# EAGLE design midiprog3c (EAGLE 4.16)
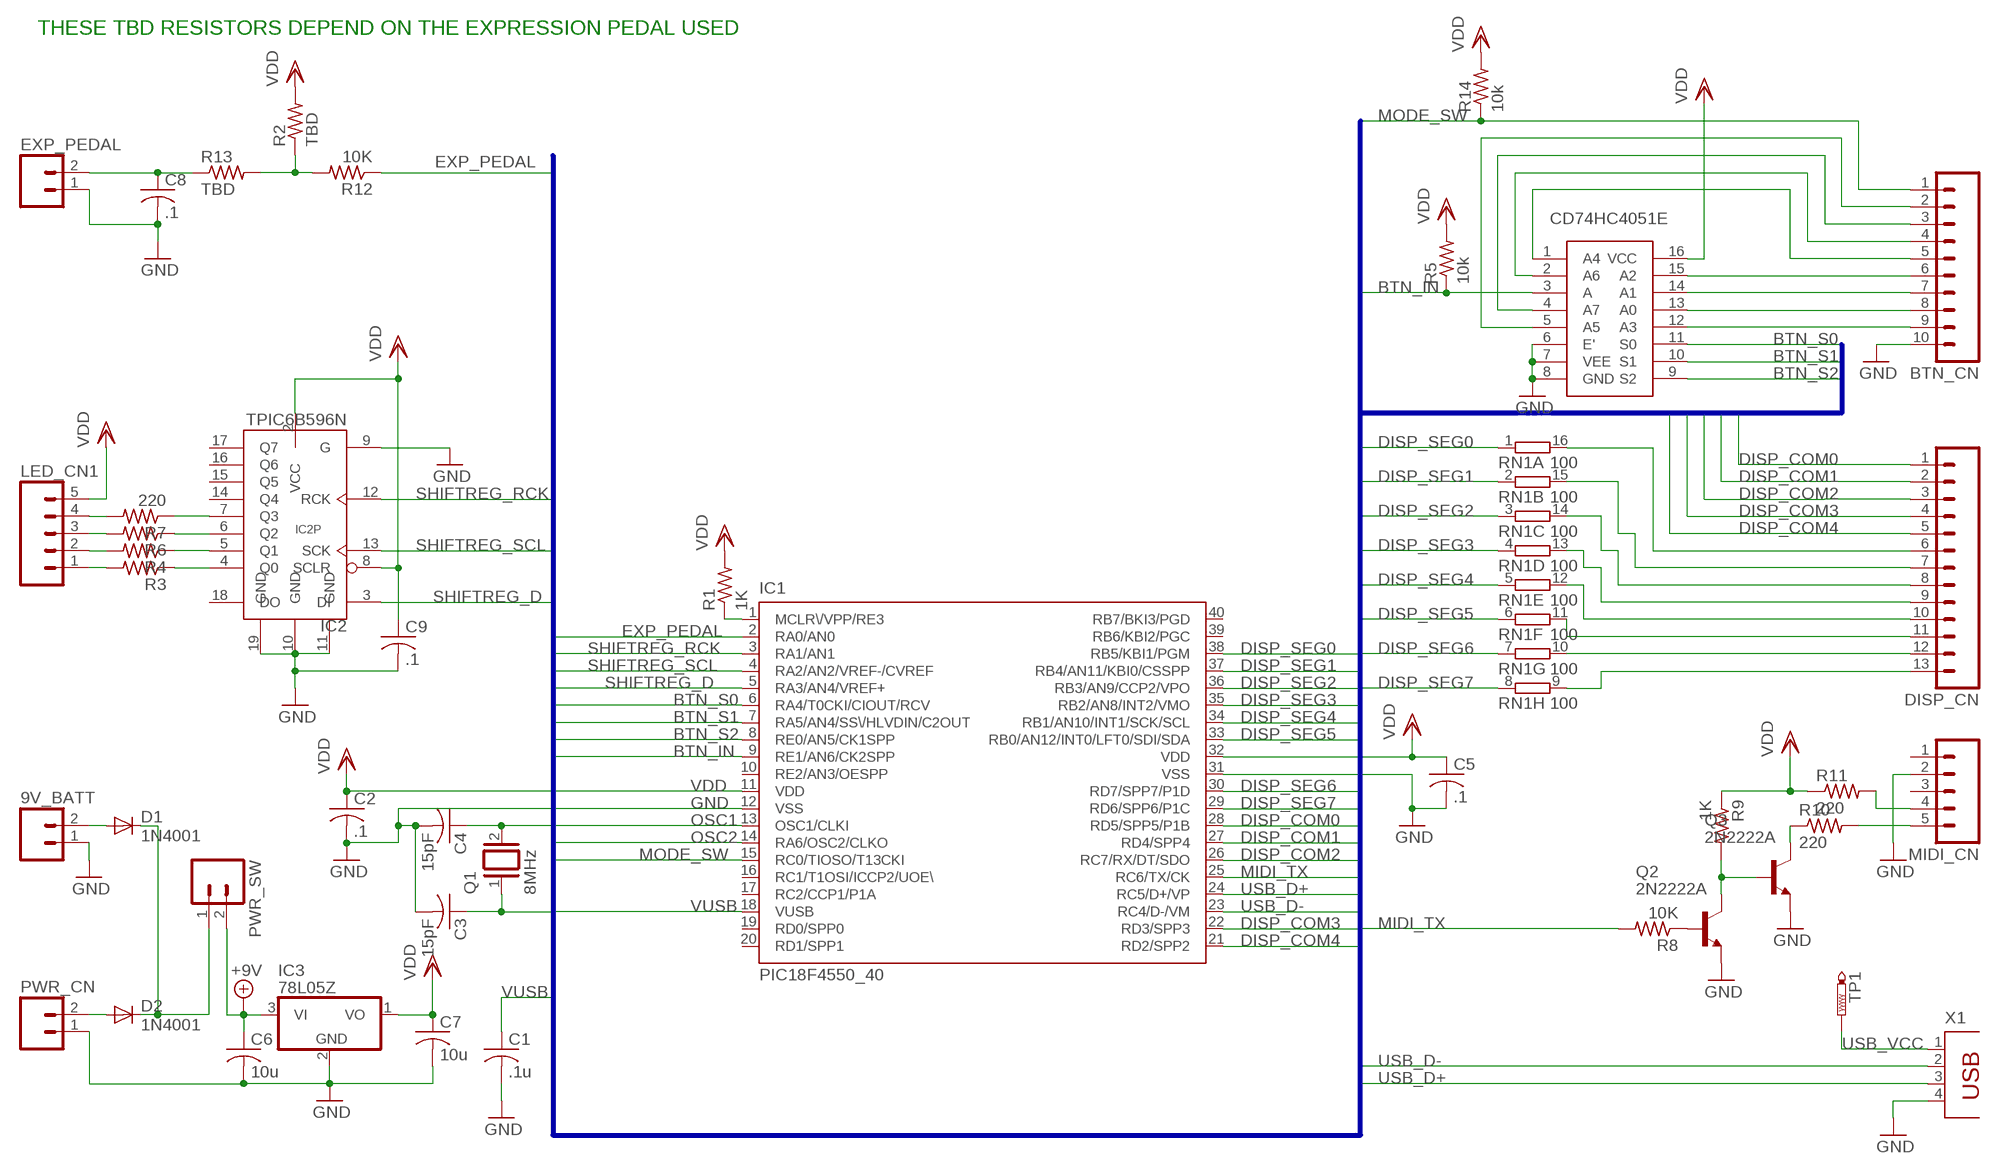
[diagram p0: schematic, sheet 1]

## Parts
9V_BATT  M02  [02P]
BTN_CN  M10  [10P]
C1  .1u  C-US050-025X075  [C050-025X075]
C2  .1  C-US050-025X075  [C050-025X075]
C3  15pF  C-US050-025X075  [C050-025X075]
C4  15pF  C-US050-025X075  [C050-025X075]
C5  .1  C-US050-025X075  [C050-025X075]
C6  10u  C-US050-025X075  [C050-025X075]
C7  10u  C-US050-025X075  [C050-025X075]
C8  .1  C-US050-025X075  [C050-025X075]
C9  .1  C-US050-025X075  [C050-025X075]
D1  1N4001  1N4004  [DO41-10]
D2  1N4001  1N4004  [DO41-10]
DISP_CN  M13  [13P]
EXP_PEDAL  M02  [02P]
IC1  PIC18F4550_40  [DIL40]
IC2  TPIC6B596N  [DIL20]
IC3  78L05Z  [TO92]
LED_CN1  M05  [05P]
MIDI_CN  MA05  [05PA]
PWR_CN  M02  [02P]
PWR_SW  M02  [02P]
Q1  8MHz  XTAL  [Q]
Q2  2N2222A  [TO18]
Q3  2N2222A  [TO18]
R1  1K  R-US_0207/10  [0207/10]
R2  TBD  R-US_0207/10  [0207/10]
R3  R-US_0207/10  [0207/10]
R4  R-US_0207/10  [0207/10]
R5  10k  R-US_0207/10  [0207/10]
R6  R-US_0207/10  [0207/10]
R7  220  R-US_0207/10  [0207/10]
R8  10K  R-US_0207/10  [0207/10]
R9  1K  R-US_0207/10  [0207/10]
R10  220  R-US_0207/10  [0207/10]
R11  220  R-US_0207/10  [0207/10]
R12  10K  R-US_0207/10  [0207/10]
R13  TBD  R-US_0207/10  [0207/10]
R14  10k  R-US_0207/10  [0207/10]
RN1  100  8R-N  [DIL16]
TP1  PTR1PAD1-17  [P1-17]
U$1  CD74HC4051E  [CD74HC4051E]
X1  PN61729  [PN61729]

## Nets
+9V: C6.1 IC3.3(VI) PWR_SW.2
BTN_IN: IC1.9(RE1/AN6/CK2SPP) R5.1 U$1.3(A)
BTN_S0: IC1.6(RA4/T0CKI/CIOUT/RCV) U$1.11(S0)
BTN_S1: IC1.7(RA5/AN4/SS\/HLVDIN/C2OUT) U$1.10(S1)
BTN_S2: IC1.8(RE0/AN5/CK1SPP) U$1.9(S2)
DISP_COM0: DISP_CN.1 IC1.28(RD5/SPP5/P1B)
DISP_COM1: DISP_CN.2 IC1.27(RD4/SPP4)
DISP_COM2: DISP_CN.3 IC1.26(RC7/RX/DT/SDO)
DISP_COM3: DISP_CN.4 IC1.22(RD3/SPP3)
DISP_COM4: DISP_CN.5 IC1.21(RD2/SPP2)
DISP_SEG0: IC1.38(RB5/KBI1/PGM) RN1.1
DISP_SEG1: IC1.37(RB4/AN11/KBI0/CSSPP) RN1.2
DISP_SEG2: IC1.36(RB3/AN9/CCP2/VPO) RN1.3
DISP_SEG3: IC1.35(RB2/AN8/INT2/VMO) RN1.4
DISP_SEG4: IC1.34(RB1/AN10/INT1/SCK/SCL) RN1.5
DISP_SEG5: IC1.33(RB0/AN12/INT0/LFT0/SDI/SDA) RN1.6
DISP_SEG6: IC1.30(RD7/SPP7/P1D) RN1.7
DISP_SEG7: IC1.29(RD6/SPP6/P1C) RN1.8
EXP_PEDAL: IC1.2(RA0/AN0) R12.1
GND: 9V_BATT.1 BTN_CN.10 C1.2 C2.2 C3.2 C4.2 C5.2 C6.2 C7.2 C8.2 C9.2 EXP_PEDAL.1 IC1.12(VSS) IC1.31(VSS) IC2.9(G) IC2.10(GND) IC2.11(GND) IC2.19(GND) IC3.2(GND) MIDI_CN.2 PWR_CN.1 Q2.1(E) Q3.1(E) U$1.6(E') U$1.7(VEE) U$1.8(GND) X1.4
MIDI_TX: IC1.25(RC6/TX/CK) R8.2
MODE_SW: BTN_CN.1 IC1.15(RC0/TIOSO/T13CKI) R14.1
N$1: IC1.1(MCLR\/VPP/RE3) R1.1
N$2: BTN_CN.3 U$1.4(A7)
N$3: IC2.4(Q0) R3.1
N$4: Q2.2(B) R8.1
N$5: Q2.3(C) Q3.2(B) R9.2
N$6: LED_CN1.1 R3.2
N$7: Q3.3(C) R10.1
N$8: MIDI_CN.5 R10.2
N$9: MIDI_CN.4 R11.2
N$10: BTN_CN.6 U$1.15(A2)
N$11: BTN_CN.7 U$1.14(A1)
N$12: BTN_CN.8 U$1.13(A0)
N$13: BTN_CN.9 U$1.12(A3)
N$14: BTN_CN.4 U$1.2(A6)
N$15: BTN_CN.5 U$1.1(A4)
N$16: DISP_CN.13 RN1.9
N$17: DISP_CN.12 RN1.10
N$18: DISP_CN.11 RN1.11
N$19: DISP_CN.10 RN1.12
N$20: DISP_CN.9 RN1.13
N$21: DISP_CN.8 RN1.14
N$22: DISP_CN.7 RN1.15
N$23: DISP_CN.6 RN1.16
N$24: LED_CN1.2 R4.2
N$25: IC2.5(Q1) R4.1
N$26: IC2.6(Q2) R6.1
N$27: LED_CN1.3 R6.2
N$28: LED_CN1.4 R7.2
N$29: IC2.7(Q3) R7.1
N$30: BTN_CN.2 U$1.5(A5)
N$31: C8.1 EXP_PEDAL.2 R13.1
N$32: R2.1 R12.2 R13.2
N$33: 9V_BATT.2 D1.A
N$34: D2.A PWR_CN.2
N$35: D1.C D2.C PWR_SW.1
OSC1: C4.1 IC1.13(OSC1/CLKI) Q1.2
OSC2: C3.1 IC1.14(RA6/OSC2/CLKO) Q1.1
SHIFTREG_D: IC1.5(RA3/AN4/VREF+) IC2.3(DI)
SHIFTREG_RCK: IC1.3(RA1/AN1) IC2.12(RCK)
SHIFTREG_SCL: IC1.4(RA2/AN2/VREF-/CVREF) IC2.13(SCK)
USB_D+: IC1.24(RC5/D+/VP) X1.3
USB_D-: IC1.23(RC4/D-/VM) X1.2
USB_VCC: TP1.1(TP) X1.1
VDD: C2.1 C5.1 C7.1 C9.1 IC1.11(VDD) IC1.32(VDD) IC2.2(VCC) IC2.8(SCLR) IC3.1(VO) LED_CN1.5 R1.2 R2.2 R5.2 R9.1 R11.1 R14.2 U$1.16(VCC)
VUSB: C1.1 IC1.18(VUSB)
Unconnected: IC1.10(RE2/AN3/OESPP) IC1.16(RC1/T1OSI/ICCP2/UOE\) IC1.17(RC2/CCP1/P1A) IC1.19(RD0/SPP0) IC1.20(RD1/SPP1) IC1.39(RB6/KBI2/PGC) IC1.40(RB7/BKI3/PGD) IC2.14(Q4) IC2.15(Q5) IC2.16(Q6) IC2.17(Q7) IC2.18(DO) MIDI_CN.1 MIDI_CN.3

## Buses
BUS1

## Notes on the sheet
- THESE TBD RESISTORS DEPEND ON THE EXPRESSION PEDAL USED

## Library data of the parts
9V_BATT EXP_PEDAL PWR_CN PWR_SW = con-amp-quick:M02: AMP QUICK CONNECTOR
BTN_CN = con-amp-quick:M10: AMP QUICK CONNECTOR
C1-C9 = rcl:C-US: CAPACITOR, American symbol
D1 D2 = diode:1N4004: DIODE general purpose rectifier, 1 A
DISP_CN = con-amp-quick:M13: AMP QUICK CONNECTOR
IC1 = microchip:PIC18F4*_40: USB Microcontrollers with nanoWatt Technology High-Performance, Enhanced Flash, 28/40/44-Pin, Source: http://ww1.microchip.com/downloads/en/devicedoc/39632c.pdf
IC2 = tpic:TPIC6B596
IC3 = linear:78*: Positive VOLTAGE REGULATOR Source: http://cache.national.com/ds/LM/LM78L05.pdf http://www.fairchildsemi.com/ds/LM/LM7805.pdf
LED_CN1 = con-amp-quick:M05: AMP QUICK CONNECTOR
MIDI_CN = con-amp-quick:MA05: AMP QUICK CONNECTOR
Q1 = special:XTAL: CRYSTAL
Q2 Q3 = transistor-npn:2N2222*: NPN Transistor
R1-R14 = rcl:R-US_: RESISTOR, American symbol
RN1 = resistor-dil:8R-N: DIL RESISTOR
TP1 = testpad:PTR1: TEST PIN
U$1 = joe:CD74HC4051E
X1 = con-berg:PN61729: BERG USB connector

## Board
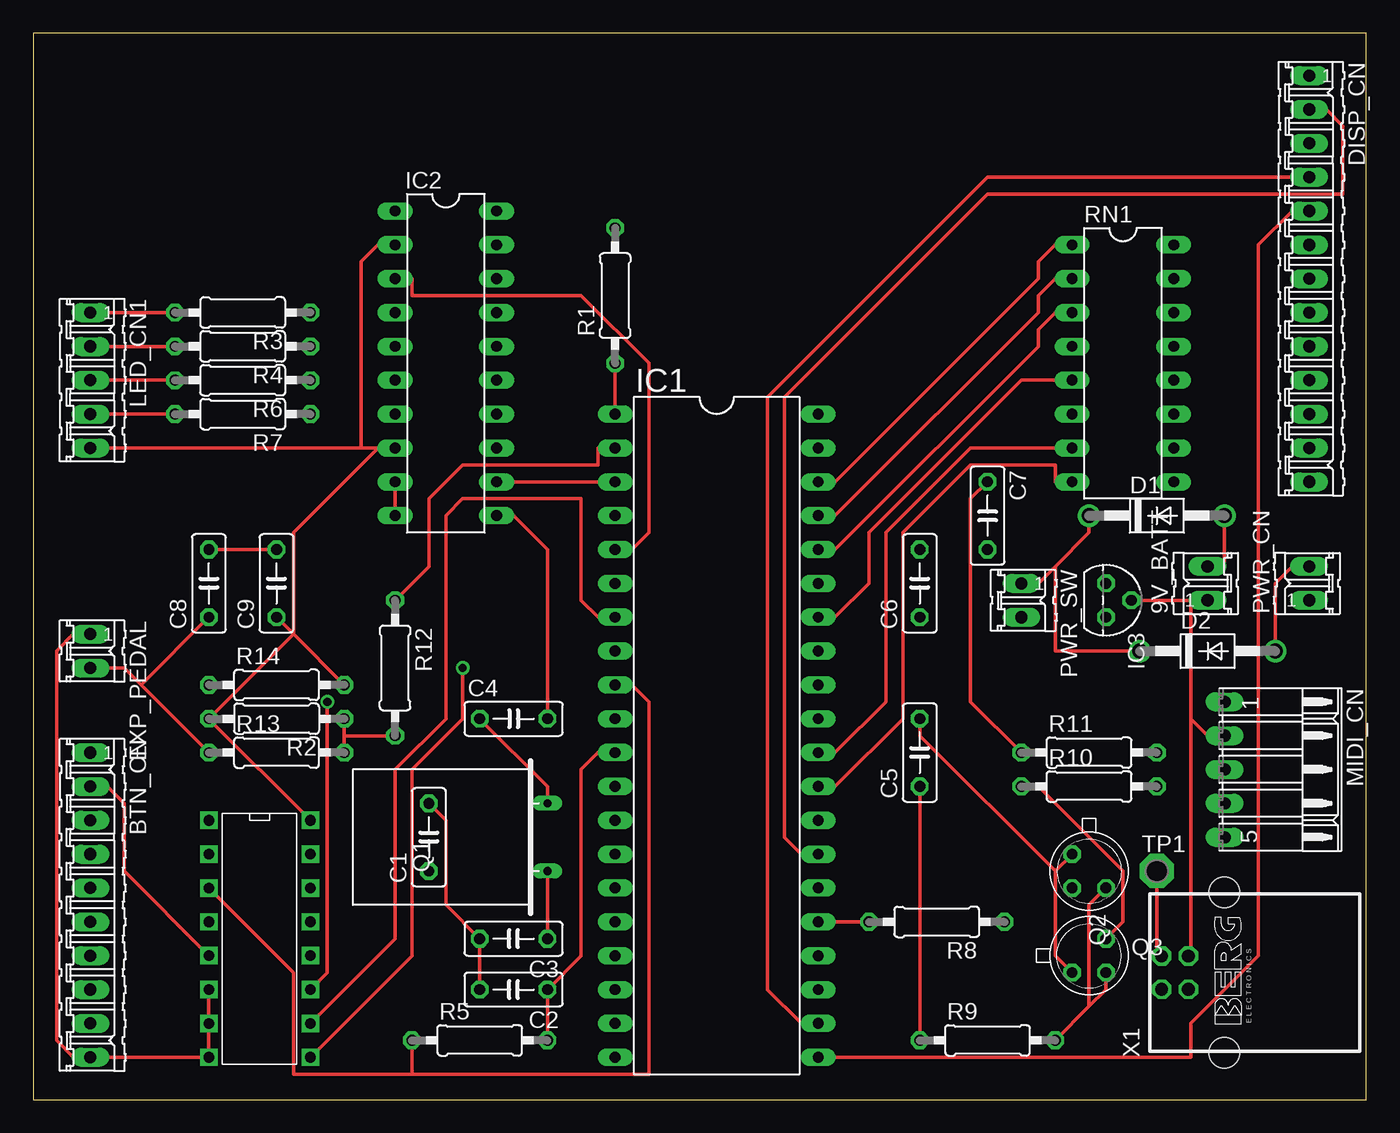
[diagram p1: board, top side]
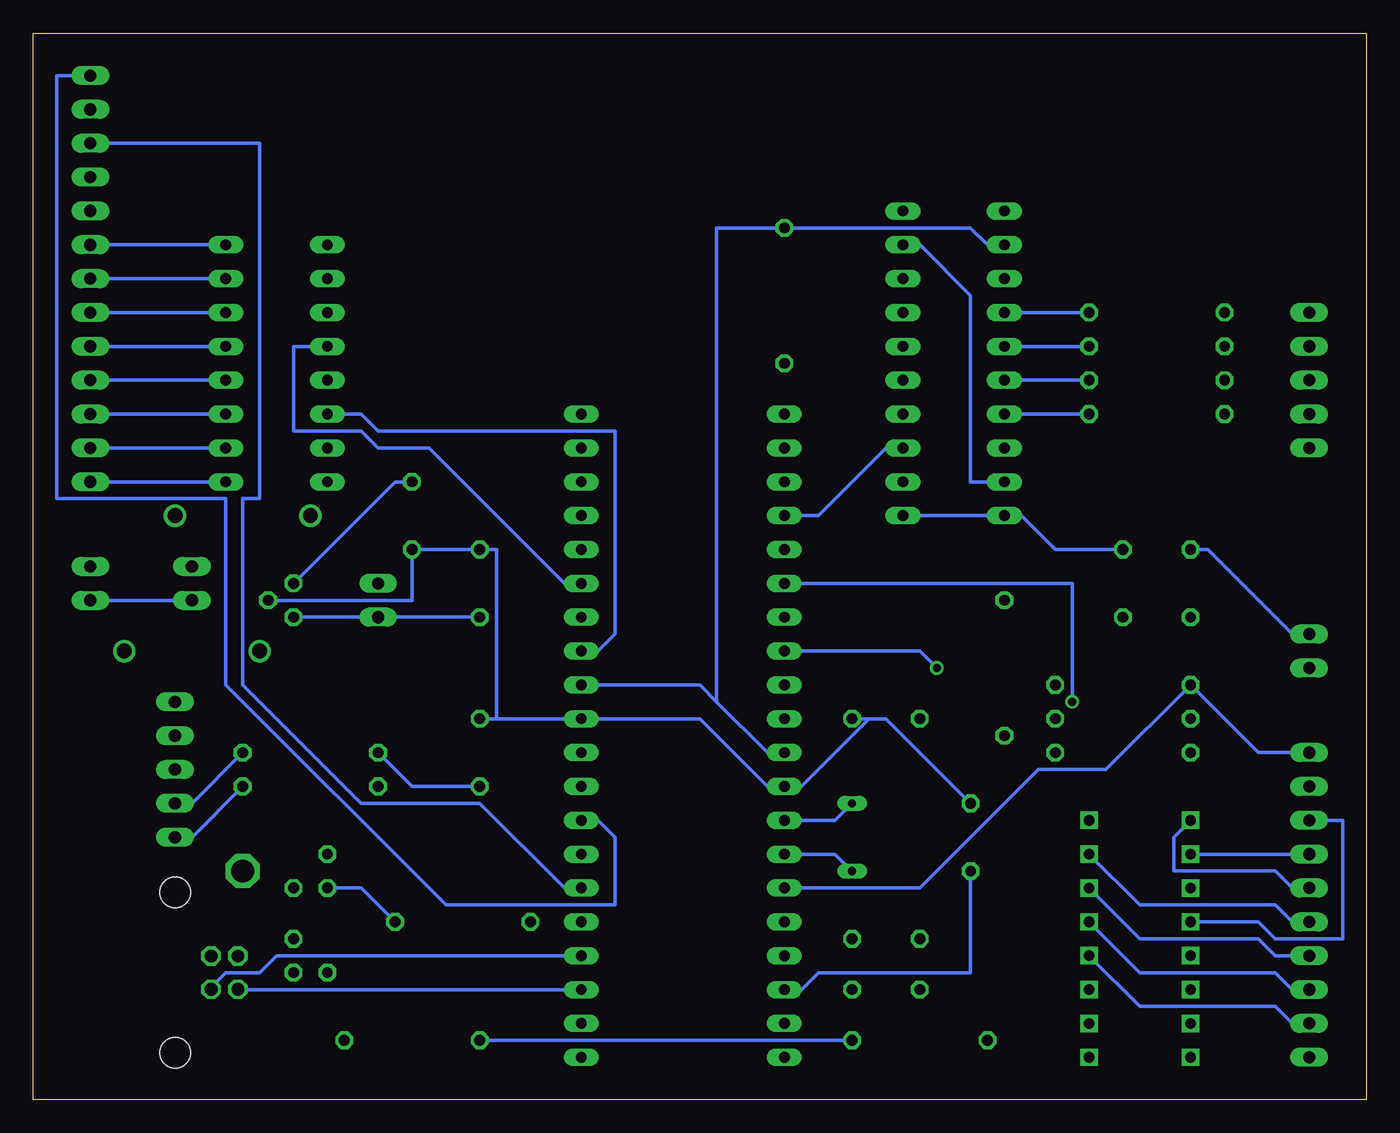
[diagram p2: board, bottom side, seen from below]

Size 100 x 80 mm. Coordinates in mm from the lower left corner, seen from the top.
Outline: 0,0 100,0 100,80 0,80 0,0
Copper layers (1*16): Top 0.035mm / dielectric 1.5mm / Bottom 0.035mm
Design rules "default": minimum track width 10mil, minimum drill 24mil, track to track 8mil, track to pad 8mil, pad to pad 8mil, via to via 8mil, smd to smd 8mil, copper to edge 40mil, drill to drill 8mil, minimum pad ring 10mil, minimum via ring 8mil, stop-mask expansion 4mil, vias tented up to drill 0mil, thermal gap 10mil

### Footprints (pad centres in the part's own frame; a part is rotated, then mirrored left to right if it is on the bottom)
02P = drill 0.914 long: 1 -1.27,0; 2 1.27,0
10P = drill 0.914 long: 1 -11.43,0; 2 -8.89,0; 3 -6.35,0; 4 -3.81,0; 5 -1.27,0; 6 1.27,0; 7 3.81,0; 8 6.35,0; 9 8.89,0; 10 11.43,0
C050-025X075 = drill 0.813 octagon: 1 -2.54,0; 2 2.54,0
DO41-10 = drill 1.118 round: A 5.08,0; C -5.08,0
13P = drill 0.914 long: 1 -15.24,0; 2 -12.7,0; 3 -10.16,0; 4 -7.62,0; 5 -5.08,0; 6 -2.54,0; 7 0,0; 8 2.54,0; 9 5.08,0; 10 7.62,0; 11 10.16,0; 12 12.7,0; 13 15.24,0
DIL40 = drill 0.813 long: 1 -24.13,-7.62; 2 -21.59,-7.62; 3 -19.05,-7.62; 4 -16.51,-7.62; 5 -13.97,-7.62; 6 -11.43,-7.62; 7 -8.89,-7.62; 8 -6.35,-7.62; 9 -3.81,-7.62; 10 -1.27,-7.62; 11 1.27,-7.62; 12 3.81,-7.62; 13 6.35,-7.62; 14 8.89,-7.62; 15 11.43,-7.62; 16 13.97,-7.62; 17 16.51,-7.62; 18 19.05,-7.62; 19 21.59,-7.62; 20 24.13,-7.62; 21 24.13,7.62; 22 21.59,7.62; 23 19.05,7.62; 24 16.51,7.62; 25 13.97,7.62; 26 11.43,7.62; 27 8.89,7.62; 28 6.35,7.62; 29 3.81,7.62; 30 1.27,7.62; 31 -1.27,7.62; 32 -3.81,7.62; 33 -6.35,7.62; 34 -8.89,7.62; 35 -11.43,7.62; 36 -13.97,7.62; 37 -16.51,7.62; 38 -19.05,7.62; 39 -21.59,7.62; 40 -24.13,7.62
DIL20 = drill 0.813 long: 1 -11.43,-3.81; 2 -8.89,-3.81; 3 -6.35,-3.81; 4 -3.81,-3.81; 5 -1.27,-3.81; 6 1.27,-3.81; 7 3.81,-3.81; 8 6.35,-3.81; 9 8.89,-3.81; 10 11.43,-3.81; 11 11.43,3.81; 12 8.89,3.81; 13 6.35,3.81; 14 3.81,3.81; 15 1.27,3.81; 16 -1.27,3.81; 17 -3.81,3.81; 18 -6.35,3.81; 19 -8.89,3.81; 20 -11.43,3.81
TO92 = drill 0.813 octagon: 1 -1.27,0; 2 0,1.905; 3 1.27,0
05P = drill 0.914 long: 1 -5.08,0; 2 -2.54,0; 3 0,0; 4 2.54,0; 5 5.08,0
05PA = drill 0.914 long: 1 -5.08,0; 2 -2.54,0; 3 0,0; 4 2.54,0; 5 5.08,0
Q = drill 0.61 long: 1 -2.54,-7.62; 2 2.54,-7.62
TO18 = drill 0.813 octagon: 1 -1.27,-1.27; 2 1.27,-1.27; 3 1.27,1.27
0207/10 = drill 0.813 octagon: 1 -5.08,0; 2 5.08,0
DIL16 = drill 0.813 long: 1 -8.89,-3.81; 2 -6.35,-3.81; 3 -3.81,-3.81; 4 -1.27,-3.81; 5 1.27,-3.81; 6 3.81,-3.81; 7 6.35,-3.81; 8 8.89,-3.81; 9 8.89,3.81; 10 6.35,3.81; 11 3.81,3.81; 12 1.27,3.81; 13 -1.27,3.81; 14 -3.81,3.81; 15 -6.35,3.81; 16 -8.89,3.81
P1-17 = drill 1.702 pad 2.54 octagon: 1 0,0
CD74HC4051E = drill 0.8 square: 1 -10.16,-7.62; 2 -7.62,-7.62; 3 -5.08,-7.62; 4 -2.54,-7.62; 5 0,-7.62; 6 2.54,-7.62; 7 5.08,-7.62; 8 7.62,-7.62; 9 7.62,0; 10 5.08,0; 11 2.54,0; 12 0,0; 13 -2.54,0; 14 -5.08,0; 15 -7.62,0; 16 -10.16,0
PN61729 = drill 0.95 octagon: 1 1.25,4.71; 2 -1.25,4.71; 3 -1.25,2.71; 4 1.25,2.71 | hole 2.3: -6.02,0; 6.02,0

### Placement (x,y rotation side)
9V_BATT  88.1,38.73 90 top
BTN_CN  4.28,14.6 270 top
C1  29.68,19.68 90 top
C2  36.03,8.25 180 top
C3  36.03,12.06 180 top
C4  36.03,28.57 0 top
C5  66.51,26.03 90 top
C6  66.51,38.73 90 top
C7  71.59,43.81 270 top
C8  13.17,38.73 90 top
C9  18.25,38.73 90 top
D1  84.29,43.81 0 top
D2  88.1,33.65 0 top
DISP_CN  95.72,61.59 270 top
EXP_PEDAL  4.28,33.65 270 top
IC1  51.27,27.3 270 top
IC2  30.95,55.24 270 top
IC3  80.48,37.46 270 top
LED_CN1  4.28,53.97 270 top
MIDI_CN  89.37,24.76 270 top
PWR_CN  95.72,38.73 90 top
PWR_SW  74.13,37.46 270 top
Q1  30.95,19.68 90 top
Q2  79.21,17.14 270 top
Q3  79.21,10.79 0 top
R1  43.65,60.32 90 top
R2  18.25,28.57 180 top
R3  15.71,59.05 180 top
R4  15.71,56.51 180 top
R5  33.49,4.44 0 top
R6  15.71,53.97 180 top
R7  15.71,51.43 180 top
R8  67.78,13.33 180 top
R9  71.59,4.44 0 top
R10  79.21,23.49 0 top
R11  79.21,26.03 0 top
R12  27.14,32.38 270 top
R13  18.25,26.03 0 top
R14  18.25,31.11 0 top
RN1  81.75,55.24 270 top
TP1  84.29,17.14 0 top
U$1  20.79,10.79 270 top
X1  89.37,9.52 90 top

### Tracks (layer width: path | path; a pad name or v marks a point on that pad's centre or on a via)
+9V
  Bottom 0.254: C6.1 PWR_SW.2 IC3.3
BTN_IN
  Top 0.254: U$1.3 19.52,9.52 19.52,1.9 28.41,1.9 | 28.41,1.9 R5.1 | 28.41,1.9 46.19,1.9 46.19,29.84 44.92,31.11 IC1.9
BTN_S0  (via drill 0.61)
  Top 0.254: U$1.11 22.06,9.52 v22.06,29.84
  Bottom 0.254: v22.06,29.84 22.06,38.73 IC1.6
BTN_S1
  Top 0.254: U$1.10 27.14,12.06 27.14,24.76 30.95,28.57 30.95,43.81 32.22,45.08 41.11,45.08 41.11,37.46 42.38,36.19 IC1.7
BTN_S2  (via drill 0.61)
  Top 0.254: U$1.9 28.41,10.79 28.41,24.76 32.22,28.57 v32.22,32.38
  Bottom 0.254: v32.22,32.38 33.49,33.65 IC1.8
DISP_COM0
  Bottom 0.254: IC1.28 57.62,20.95 56.35,19.68 56.35,14.6 69.05,14.6 85.56,31.11 85.56,45.08 98.26,45.08 98.26,76.83 DISP_CN.1
DISP_COM1
  Top 0.254: IC1.27 57.62,18.41 56.35,19.68 56.35,52.7 71.59,67.94 98.26,67.94 98.26,73.02 96.99,74.29 DISP_CN.2
DISP_COM2
  Bottom 0.254: IC1.26 60.16,15.87 66.51,22.22 75.4,22.22 84.29,31.11 84.29,45.08 83.02,45.08 83.02,71.75 DISP_CN.3
DISP_COM3
  Top 0.254: IC1.22 57.62,5.71 55.08,8.25 55.08,52.7 71.59,69.21 DISP_CN.4
DISP_COM4
  Top 0.254: IC1.21 86.83,3.17 86.83,5.71 91.91,10.79 91.91,64.13 94.45,66.67 DISP_CN.5
DISP_SEG0
  Top 0.254: IC1.38 60.16,46.35 75.4,61.59 75.4,62.86 76.67,64.13 RN1.1
DISP_SEG1
  Top 0.254: IC1.37 60.16,43.81 75.4,59.05 75.4,60.32 76.67,61.59 RN1.2
DISP_SEG2
  Top 0.254: IC1.36 60.16,41.27 75.4,56.51 75.4,57.78 76.67,59.05 RN1.3
DISP_SEG3
  Bottom 0.254: IC1.35 60.16,38.73 70.32,48.89 74.13,48.89 75.4,50.16 80.48,50.16 80.48,56.51 RN1.4
DISP_SEG4
  Top 0.254: IC1.34 60.16,36.19 62.7,38.73 62.7,42.54 74.13,53.97 RN1.5
DISP_SEG5
  Bottom 0.254: IC1.33 57.62,33.65 56.35,34.92 56.35,50.16 74.13,50.16 75.4,51.43 RN1.6
DISP_SEG6
  Top 0.254: IC1.30 60.16,26.03 63.97,29.84 63.97,42.54 70.32,48.89 RN1.7
DISP_SEG7
  Top 0.254: IC1.29 60.16,23.49 65.24,28.57 65.24,42.54 70.32,47.62 76.67,47.62 76.67,46.35 RN1.8
EXP_PEDAL
  Top 0.254: R12.1 29.68,40 29.68,45.08 32.22,47.62 42.38,47.62 42.38,48.89 IC1.2
GND
  Top 0.254: IC2.10 IC2.9 | U$1.6 U$1.7 U$1.8 BTN_CN.10 3.01,3.17 1.74,4.44 1.74,33.65 3.01,34.92 EXP_PEDAL.1 | C8.2 C9.2 | C2.2 C3.2 30.95,14.6 30.95,20.95 C1.2 | Q3.1 76.67,10.79 76.67,17.14 | 76.67,17.14 Q2.1 | IC3.2 86.83,37.46 | 86.83,28.57 88.1,27.3 MIDI_CN.2 | 86.83,37.46 86.83,28.57 | 86.83,37.46 9V_BATT.1 | 86.83,28.57 86.83,10.79 X1.4 | 76.67,17.14 66.51,27.3 C5.2 | C4.2 38.57,41.27 36.03,43.81 IC2.11
  Bottom 0.254: IC2.11 IC2.10 25.87,43.81 23.33,41.27 C9.2 | IC2.19 33.49,64.13 29.68,60.32 29.68,46.35 IC2.9 | C8.2 11.9,41.27 5.55,34.92 EXP_PEDAL.1 | C1.2 36.03,28.57 37.3,28.57 | C4.2 37.3,28.57 | 37.3,28.57 42.38,23.49 IC1.12 44.92,23.49 50,28.57 IC1.31 65.24,28.57 | 65.24,28.57 C5.2 | 9V_BATT.1 PWR_CN.1 | IC3.2 71.59,37.46 C7.2 C6.2 65.24,41.27 65.24,28.57
MIDI_TX
  Top 0.254: IC1.25 R8.2
MODE_SW
  Bottom 0.254: BTN_CN.1 8.09,26.03 R14.1 19.52,24.76 24.6,24.76 33.49,15.87 IC1.15
N$1
  Top 0.254: IC1.1 R1.1
N$2
  Bottom 0.254: U$1.4 8.09,13.33 6.82,12.06 1.74,12.06 1.74,20.95 BTN_CN.3
N$3
  Bottom 0.254: R3.1 IC2.4
N$4
  Bottom 0.254: R8.1 75.4,15.87 Q2.2
N$5
  Top 0.254: 79.21,6.98 80.48,8.25 Q3.2 | R9.2 79.21,6.98 | Q2.3 79.21,14.6 79.21,6.98
N$6
  Top 0.254: LED_CN1.1 R3.2
N$7
  Top 0.254: Q3.3 81.75,13.33 81.75,17.14 75.4,23.49 R10.1
N$8
  Bottom 0.254: R10.2 88.1,19.68 MIDI_CN.5
N$9
  Bottom 0.254: R11.2 88.1,22.22 MIDI_CN.4
N$10
  Bottom 0.254: U$1.15 16.98,14.6 6.82,14.6 5.55,13.33 BTN_CN.6
N$11
  Bottom 0.254: U$1.14 16.98,12.06 8.09,12.06 6.82,10.79 BTN_CN.7
N$12
  Bottom 0.254: U$1.13 16.98,9.52 6.82,9.52 5.55,8.25 BTN_CN.8
N$13
  Bottom 0.254: U$1.12 16.98,6.98 6.82,6.98 5.55,5.71 BTN_CN.9
N$14
  Bottom 0.254: BTN_CN.4 U$1.2
N$15
  Bottom 0.254: U$1.1 14.44,19.68 14.44,17.14 6.82,17.14 5.55,15.87 BTN_CN.5
N$16
  Bottom 0.254: RN1.9 DISP_CN.13
N$17
  Bottom 0.254: RN1.10 DISP_CN.12
N$18
  Bottom 0.254: RN1.11 DISP_CN.11
N$19
  Bottom 0.254: RN1.12 DISP_CN.10
N$20
  Bottom 0.254: RN1.13 DISP_CN.9
N$21
  Bottom 0.254: RN1.14 DISP_CN.8
N$22
  Bottom 0.254: RN1.15 DISP_CN.7
N$23
  Bottom 0.254: RN1.16 DISP_CN.6
N$24
  Top 0.254: LED_CN1.2 R4.2
N$25
  Bottom 0.254: R4.1 IC2.5
N$26
  Bottom 0.254: R6.1 IC2.6
N$27
  Top 0.254: LED_CN1.3 R6.2
N$28
  Top 0.254: LED_CN1.4 R7.2
N$29
  Bottom 0.254: R7.1 IC2.7
N$30
  Top 0.254: U$1.5 6.82,17.14 6.82,22.22 5.55,23.49 BTN_CN.2
N$31
  Top 0.254: 8.09,31.11 6.82,32.38 EXP_PEDAL.2 | 8.09,31.11 R13.1 | 8.09,31.11 C8.1
N$32
  Top 0.254: 23.33,27.3 R2.1 | R13.2 23.33,27.3 | 23.33,27.3 R12.2
N$33
  Top 0.254: D1.A 89.37,40 9V_BATT.2
N$34
  Top 0.254: D2.A 93.18,38.73 94.45,40 PWR_CN.2
N$35
  Top 0.254: 76.67,40 79.21,42.54 D1.C | 76.67,40 75.4,38.73 PWR_SW.1 | D2.C 76.67,33.65 76.67,40
OSC1
  Top 0.254: C4.1 38.57,23.49 Q1.2
  Bottom 0.254: Q1.2 39.84,20.95 IC1.13
OSC2
  Top 0.254: C3.1 Q1.1
  Bottom 0.254: Q1.1 39.84,18.41 IC1.14
SHIFTREG_D
  Top 0.254: IC1.5 44.92,41.27 46.19,42.54 46.19,55.24 41.11,60.32 28.41,60.32 28.41,61.59 IC2.3
SHIFTREG_RCK
  Top 0.254: IC2.12 IC1.3
SHIFTREG_SCL
  Bottom 0.254: IC2.13 36.03,48.89 41.11,43.81 IC1.4
USB_D+
  Bottom 0.254: IC1.24 81.75,10.79 83.02,9.52 85.56,9.52 86.83,8.25 X1.3
USB_D-
  Bottom 0.254: IC1.23 84.29,8.25 X1.2
USB_VCC
  Top 0.254: X1.1 84.29,10.79 TP1.1
VDD
  Top 0.254: R5.2 C2.1 41.11,10.79 41.11,24.76 42.38,26.03 IC1.11 | R9.1 C5.1 | C7.1 70.32,45.08 70.32,29.84 R11.1 | U$1.16 R2.2 19.52,34.92 | 19.52,34.92 C9.1 | 19.52,34.92 R14.2 | 25.87,48.89 19.52,42.54 19.52,34.92 | 24.6,48.89 25.87,48.89 | 24.6,48.89 LED_CN1.5 | 25.87,48.89 IC2.8 | 24.6,48.89 24.6,62.86 25.87,64.13 IC2.2
  Bottom 0.254: 48.73,29.84 50,31.11 IC1.32 | 48.73,29.84 44.92,26.03 IC1.11 | IC3.1 72.86,46.35 C7.1 | R11.1 71.59,23.49 C5.1 | R5.2 R9.1 | IC2.2 28.41,64.13 29.68,65.4 R1.2 48.73,65.4 48.73,29.84
VUSB
  Bottom 0.254: C1.1 29.68,9.52 41.11,9.52 42.38,8.25 IC1.18